# EAGLE board prism (EAGLE 6.5.0)
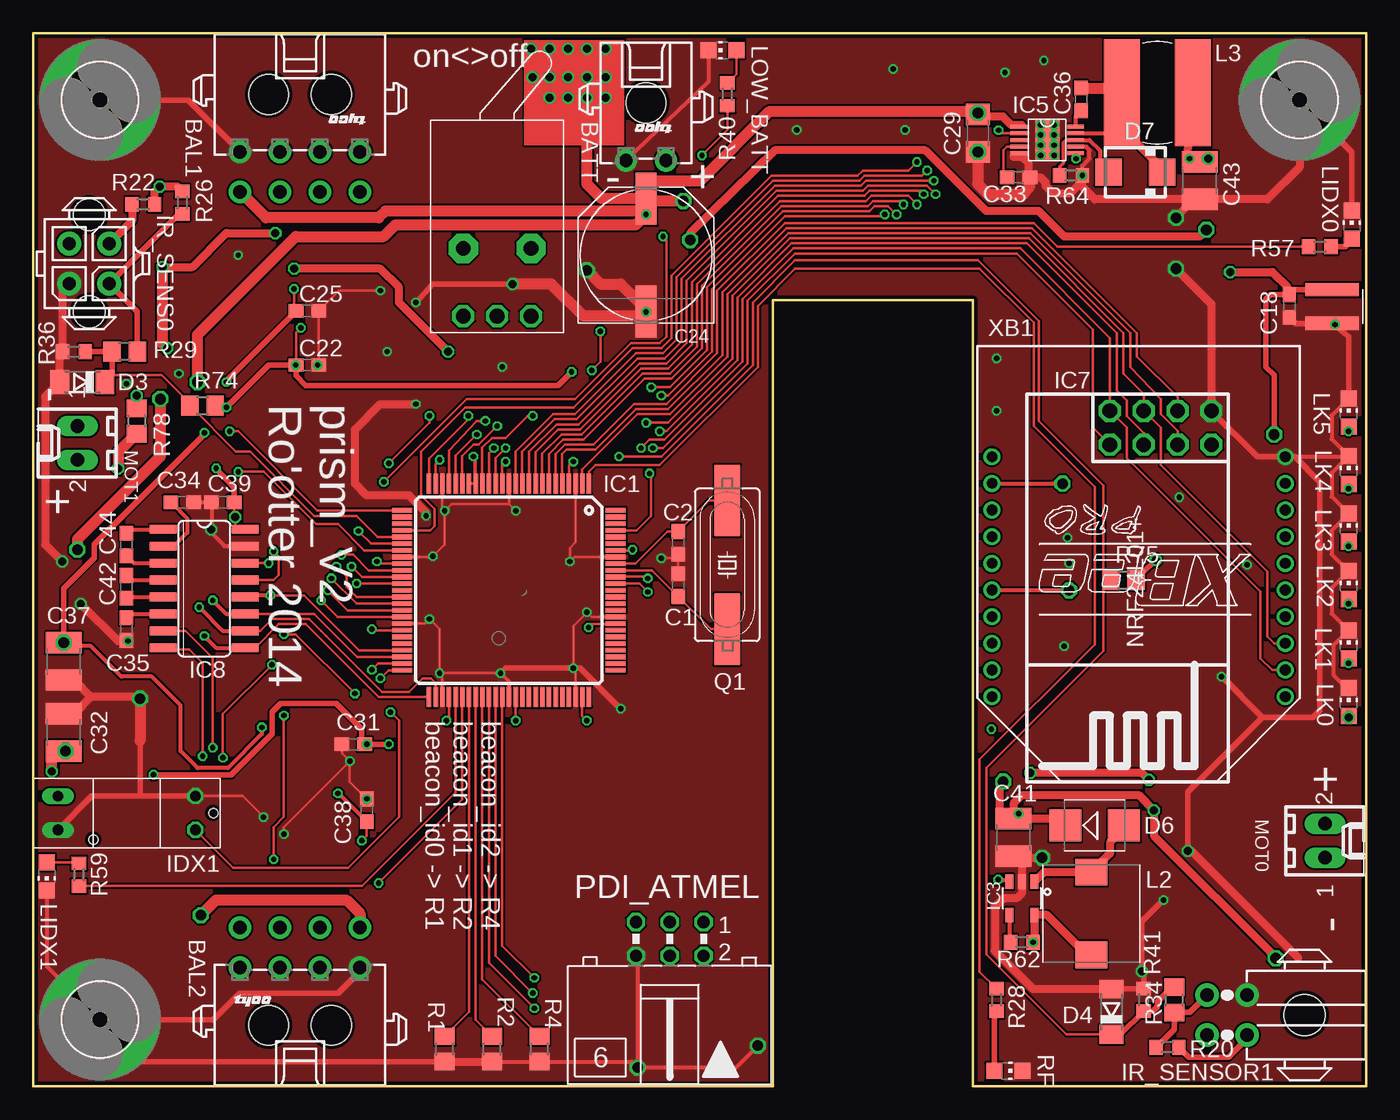
[diagram p2: board, top side]
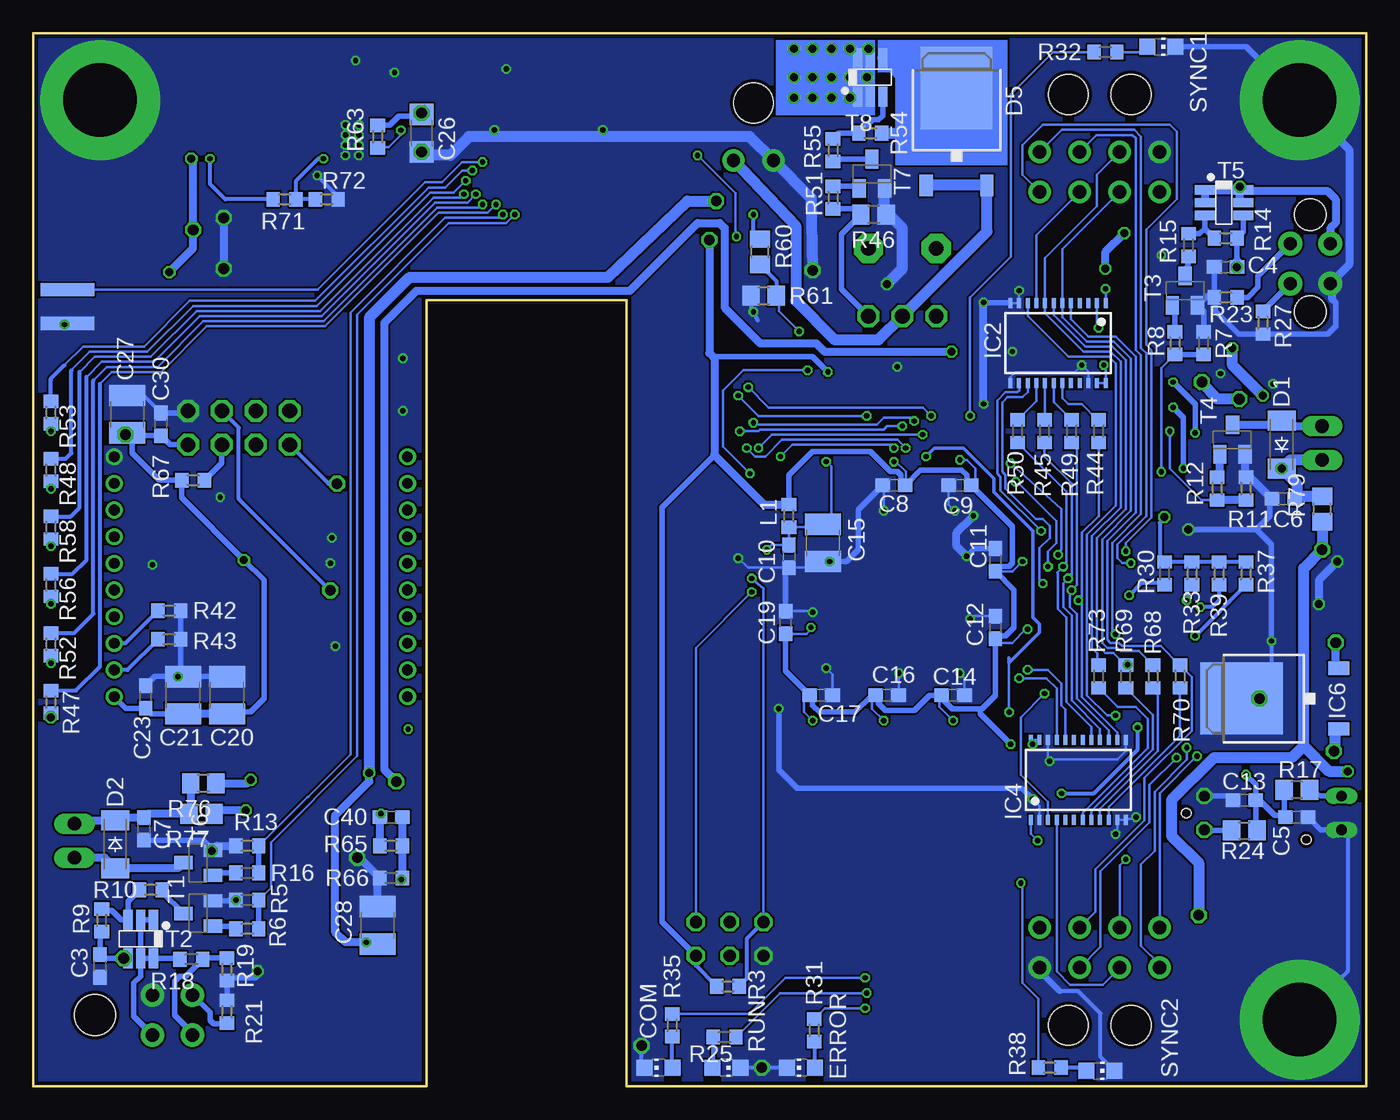
[diagram p3: board, bottom side, seen from below]

Size 100 x 79 mm. Coordinates in mm from the lower left corner, seen from the top.
Outline: 0,0 55.5,0 55.5,59 70.5,59 70.5,0 100,0 100,79 0,79 0,0
Copper layers (1*16): Top 0.035mm / dielectric 1.6mm / Bottom 0.035mm
Design rules "SeeedStudio_DRU_2layer": minimum track width 6mil, minimum drill 12mil, track to track 6mil, track to pad 6mil, pad to pad 6mil, via to via 6mil, smd to smd 0mil, copper to edge 10mil, drill to drill 10mil, minimum pad ring 6mil, minimum via ring 6mil, stop-mask expansion 2mil, vias tented up to drill 25mil, thermal gap 10mil

## Footprints (pad centres in the part's own frame; a part is rotated, then mirrored left to right if it is on the bottom)
794618-8 = drill 1 pad 1.676: 1 4.5,4.32; 2 1.5,4.32; 3 -1.5,4.32; 4 -4.5,4.32; 5 4.5,7.32; 6 1.5,7.32; 7 -1.5,7.32; 8 -4.5,7.32 | hole 3: -2.35,0; 2.35,0
1445055-2 = drill 1 pad 1.676: 1 1.5,4.32; 2 -1.5,4.32 | hole 3: 0,0
C0603 = smd 1.1 x 1: 1 -0.85,0; 2 0.85,0
C1210 = smd 1.6 x 2.7: 1 -1.4,0; 2 1.4,0
PANASONIC_G = smd 3.9 x 1.6: + 4.25,0; - -4.25,0
C1206 = smd 1.6 x 1.8: 1 -1.4,0; 2 1.4,0
CHIP-LED0805 = smd 1.2 x 1.2: A 0,-1.05; C 0,1.05
SOD-123_MINI-SMA = smd 1.5 x 2.1: A 1.8,0; C -1.8,0
SOD80C = smd 1.4 x 1.8: A 1.7,0; C -1.7,0
TO252 = smd 1 x 1.6: 1 -2.28,-4.8; 3 2.28,-4.8 | smd 5.4 x 6.2: 4 0,2.5
SMB = smd 2.4 x 2.4: A 2.2,0; C -2.2,0
SMA = smd 2 x 2: A 2,0; C -2,0
5,5-PAD = drill 5.5 pad 9: B5,5 0,0
TQFP100 = smd 1.5 x 0.347: 1 -8,6; 2 -8,5.5; 3 -8,5; 4 -8,4.5; 5 -8,4; 6 -8,3.5; 7 -8,3; 8 -8,2.5; 9 -8,2; 10 -8,1.5; 11 -8,1; 12 -8,0.5; 13 -8,0; 14 -8,-0.5; 15 -8,-1; 16 -8,-1.5; 17 -8,-2; 18 -8,-2.5; 19 -8,-3; 20 -8,-3.5; 21 -8,-4; 22 -8,-4.5; 23 -8,-5; 24 -8,-5.5; 25 -8,-6; 51 8,-6; 52 8,-5.5; 53 8,-5; 54 8,-4.5; 55 8,-4; 56 8,-3.5; 57 8,-3; 58 8,-2.5; 59 8,-2; 60 8,-1.5; 61 8,-1; 62 8,-0.5; 63 8,0; 64 8,0.5; 65 8,1; 66 8,1.5; 67 8,2; 68 8,2.5; 69 8,3; 70 8,3.5; 71 8,4; 72 8,4.5; 73 8,5; 74 8,5.5; 75 8,6 | smd 0.347 x 1.5: 26 -6,-8; 27 -5.5,-8; 28 -5,-8; 29 -4.5,-8; 30 -4,-8; 31 -3.5,-8; 32 -3,-8; 33 -2.5,-8; 34 -2,-8; 35 -1.5,-8; 36 -1,-8; 37 -0.5,-8; 38 0,-8; 39 0.5,-8; 40 1,-8; 41 1.5,-8; 42 2,-8; 43 2.5,-8; 44 3,-8; 45 3.5,-8; 46 4,-8; 47 4.5,-8; 48 5,-8; 49 5.5,-8; 50 6,-8; 76 6,8; 77 5.5,8; 78 5,8; 79 4.5,8; 80 4,8; 81 3.5,8; 82 3,8; 83 2.5,8; 84 2,8; 85 1.5,8; 86 1,8; 87 0.5,8; 88 0,8; 89 -0.5,8; 90 -1,8; 91 -1.5,8; 92 -2,8; 93 -2.5,8; 94 -3,8; 95 -3.5,8; 96 -4,8; 97 -4.5,8; 98 -5,8; 99 -5.5,8; 100 -6,8
TSSOP24 = smd 0.3 x 0.75: 1 -3.575,-3; 2 -2.925,-3; 3 -2.275,-3; 4 -1.625,-3; 5 -0.975,-3; 6 -0.325,-3; 7 0.325,-3; 8 0.975,-3; 9 1.625,-3; 10 2.275,-3; 11 2.925,-3; 12 3.575,-3; 13 3.575,3; 14 2.925,3; 15 2.275,3; 16 1.625,3; 17 0.975,3; 18 0.325,3; 19 -0.325,3; 20 -0.975,3; 21 -1.625,3; 22 -2.275,3; 23 -2.925,3; 24 -3.575,3
SOT23-5 = smd 0.6 x 1.1: 1 -0.95,-1.25; 2 0,-1.25; 3 0.95,-1.25; 4 0.95,1.25; 5 -0.95,1.25
MSOP10_THERMAL = smd 0.3 x 1.25: 1 -1,-2.127; 2 -0.5,-2.127; 3 0,-2.127; 4 0.5,-2.127; 5 1,-2.127; 6 1,2.127; 7 0.5,2.127; 8 0,2.127; 9 -0.5,2.127; 10 -1,2.127 | smd 3 x 1.8: THERMAL 0,0
DPACK_3 = smd 1 x 1.6: 1 -2.28,-4.8; 3 2.28,-4.8 | smd 5.4 x 6.2: 4 0,2.5
NRF24L01+ = drill 1.1 octagon: 1 1.27,-3.81; 2 -1.27,-3.81; 3 1.27,-1.27; 4 -1.27,-1.27; 5 1.27,1.27; 6 -1.27,1.27; 7 1.27,3.81; 8 -1.27,3.81
SO16 = smd 0.66 x 2.032: 1 -4.445,-3.073; 2 -3.175,-3.073; 3 -1.905,-3.073; 4 -0.635,-3.073; 5 0.635,-3.073; 6 1.905,-3.073; 7 3.175,-3.073; 8 4.445,-3.073; 9 4.445,3.073; 10 3.175,3.073; 11 1.905,3.073; 12 0.635,3.073; 13 -0.635,3.073; 14 -1.905,3.073; 15 -3.175,3.073; 16 -4.445,3.073
PRISM_INDEX_EXTENSION_MALE = smd 4 x 1: 1 0,-1.27; 2 0,1.27 | smd 4 x 1 bottom: 3 0,-1.27; 4 0,1.27
GP1S58VJ000F = drill 0.8 long: LED_A 5.15,-1.27; LED_C 5.15,1.27 | drill 0.8 octagon: TRANSISTOR_C -5.15,1.27; TRANSISTOR_E -5.15,-1.27 | hole 0.7: -6.5,0; 2.5,2
794681-4 = drill 1 pad 1.778: 1 1.5,-1.5; 2 1.5,1.5; 3 -1.5,-1.5; 4 -1.5,1.5 | hole 2.4: 3.63,0; -3.67,0
794618-4 = drill 1 pad 1.778: 1 1.5,4.32; 2 1.5,7.32; 3 -1.5,4.32; 4 -1.5,7.32 | hole 3.1: 0,0
R0603 = smd 1 x 1.1: 1 -0.85,0; 2 0.85,0
SRR7032 = smd 2 x 2.4: 1 -3.1,0; 2 3.1,0
SDR0805 = smd 8 x 2.7: 1 0,-2.65; 2 0,2.65
6410-02 = drill 1.016 long: 1 1.27,0; 2 -1.27,0
ML6L = drill 0.914 octagon: 1 -2.54,-1.27; 2 -2.54,1.27; 3 0,-1.27; 4 0,1.27; 5 2.54,-1.27; 6 2.54,1.27
HC49UP = smd 5.334 x 1.93: 1 -4.826,0; 2 4.826,0
R0805 = smd 1.3 x 1.5: 1 -0.95,0; 2 0.95,0
2MS1T2B4M6QNS = drill 1.1 octagon: 1 2.54,0; 2 0,0; 3 -2.54,0 | drill 1.1 pad 2.184 octagon: NC0 -2.54,-5.08; NC1 2.54,-5.08
SOT23-BEC = smd 1 x 1.4: B -0.95,-1.1; C 0,1.1; E 0.95,-1.1
TSOP-6 = smd 0.7 x 1.5: 1 -0.95,-1.45; 2 0,-1.45; 3 0.95,-1.45; 4 0.95,1.45; 5 0,1.45; 6 -0.95,1.45
XBEE-PRO = drill 0.8 pad 1.27: 1 -11,9; 2 -11,7; 3 -11,5; 4 -11,3; 5 -11,1; 6 -11,-1; 7 -11,-3; 8 -11,-5; 9 -11,-7; 10 -11,-9; 11 11,-9; 12 11,-7; 13 11,-5; 14 11,-3; 15 11,-1; 16 11,1; 17 11,3; 18 11,5; 19 11,7; 20 11,9

## Placement (x,y rotation side)
BAL1  794618-8  [794618-8]  20,74.42 180 top
BAL2  794618-8  [794618-8]  20,4.57 0 top
BATT  1445055-2  [1445055-2]  45.97,73.79 180 top
C1  15pF_0603_100V  [C0603]  48.39,37.59 90 top
C2  15pF_0603_100V  [C0603]  48.39,40.77 270 top
C3  100nF 50V  [C0603]  95,9.02 270 bottom
C4  100nF 50V  [C0603]  10.54,61.47 180 bottom
C5  100nF 50V  [C0603]  5.21,20.19 0 bottom
C6  100nF 50V  [C0603]  6.22,44.07 180 bottom
C7  100nF 50V  [C0603]  91.69,19.3 270 bottom
C8  100nF 50V  [C0603]  35.43,45.09 180 bottom
C9  100nF 50V  [C0603]  30.48,45.09 180 bottom
C10  100nF 50V  [C0603]  43.31,39.75 270 bottom
C11  100nF 50V  [C0603]  27.81,39.5 90 bottom
C12  100nF 50V  [C0603]  27.81,34.42 90 bottom
C13  100nF 50V  [C0603]  9.14,21.46 180 bottom
C14  100nF 50V  [C0603]  30.99,29.34 0 bottom
C15  10µF 25V  [C1210]  40.77,40.77 270 bottom
C16  100nF 50V  [C0603]  35.94,29.34 0 bottom
C17  100nF 50V  [C0603]  40.89,29.34 0 bottom
C18  100nF 50V  [C0603]  94.23,58.55 270 top
C19  100nF 50V  [C0603]  43.56,34.8 90 bottom
C20  10µF 25V  [C1210]  85.47,29.34 90 bottom
C21  10µF 25V  [C1210]  88.77,29.34 90 bottom
C22  100nF 50V  [C0603]  20.57,54.1 0 top
C23  100nF 50V  [C0603]  91.57,29.21 90 bottom
C24  330µF 35V  [PANASONIC_G]  45.97,62.36 90 top
C25  100nF 50V  [C0603]  20.57,58.17 0 top
C26  1µF 25V  [C1206]  70.87,71.5 270 bottom
C27  10µF 25V  [C1210]  92.96,50.42 90 bottom
C28  10µF 25V  [C1210]  74.17,12.06 90 bottom
C29  1µF 25V  [C1206]  70.87,71.5 270 top
C30  100nF 50V  [C0603]  90.42,49.66 90 bottom
C31  100nF 50V  [C0603]  24,25.65 180 top
C32  10µF 25V  [C1210]  2.29,26.54 90 top
C33  10nF 50V  [C0603]  73.91,68.2 0 top
C34  100nF 50V  [C0603]  11.18,43.81 0 top
C35  100nF 50V  [C0603]  6.99,34.29 270 top
C36  100nF 50V  [C0603]  78.61,74.04 90 top
C37  10µF 25V  [C1210]  2.29,31.88 270 top
C38  100nF 50V  [C0603]  25.02,20.7 90 top
C39  100nF 50V  [C0603]  14.22,43.81 180 top
C40  180pF 50V  [C0603]  73.15,20.19 0 bottom
C41  10µF 25V  [C1210]  73.53,18.67 270 top
C42  100nF 50V  [C0603]  6.99,37.47 270 top
C43  10µF 25V  [C1210]  87.5,67.94 270 top
C44  100nF 50V  [C0603]  6.99,40.64 270 top
COM  LED_G  [CHIP-LED0805]  53.09,1.4 90 bottom
D1  CGRM4004-G  [SOD-123_MINI-SMA]  6.35,48.13 90 bottom
D2  CGRM4004-G  [SOD-123_MINI-SMA]  93.85,18.16 270 bottom
D3  bzv55-c3v3  [SOD80C]  3.68,52.83 180 top
D4  bzv55-c3v3  [SOD80C]  80.9,5.59 90 top
D5  [TO252]  30.73,72.39 0 bottom
D6  B120-13-F  [SMB]  79.63,19.56 0 top
D7  B160-13F  [SMA]  82.68,68.58 180 top
ERROR  LED_G  [CHIP-LED0805]  42.42,1.4 90 bottom
H1  MOUNT-PAD-ROUND5.5  [5,5-PAD]  95,74 0 top
H2  MOUNT-PAD-ROUND5.5  [5,5-PAD]  5,5 0 top
H3  MOUNT-PAD-ROUND5.5  [5,5-PAD]  5,74 0 top
IC1  XMEGA128-A1  [TQFP100]  35.69,37.21 270 top
IC2  74LVC4245APW  [TSSOP24]  23.11,55.75 180 bottom
IC3  LM2731XMF  [SOT23-5]  74.17,14.1 180 top
IC4  74LVC4245APW  [TSSOP24]  21.59,22.99 0 bottom
IC5  LM25011MY  [MSOP10_THERMAL]  76.07,70.99 270 top
IC6  NCV78M05BDTRKG  [DPACK_3]  6.86,29.08 90 bottom
IC7  NRF24L01+  [NRF24L01+]  84.58,49.4 90 top
IC8  MAX3232CSE  [SO16]  12.83,37.34 270 top
IDX0  PRISM_INDEX_EXTENSION_MALE  [PRISM_INDEX_EXTENSION_MALE]  97.45,58.5 0 top
IDX1  GP1S58VJ000F  [GP1S58VJ000F]  7,20.5 180 top
IR_SENS0  794681-4  [794681-4]  4.19,61.72 270 top
IR_SENSOR1  794618-4  [794618-4]  95.38,5.33 90 top
L1  220 ohms  [R0603]  43.31,42.8 90 bottom
L2  SRR7032-100M  [SRR7032]  79.38,12.95 90 top
L3  SDR0805-270KL  [SDR0805]  84.33,74.55 270 top
LIDX0  LED_G  [CHIP-LED0805]  98.93,64.64 0 top
LIDX1  LED_G  [CHIP-LED0805]  1.02,15.75 180 top
LK0  LED_G  [CHIP-LED0805]  98.68,28.83 0 top
LK1  LED_G  [CHIP-LED0805]  98.68,33.15 0 top
LK2  LED_G  [CHIP-LED0805]  98.68,37.59 0 top
LK3  LED_G  [CHIP-LED0805]  98.68,41.91 0 top
LK4  LED_G  [CHIP-LED0805]  98.68,46.23 0 top
LK5  LED_G  [CHIP-LED0805]  98.68,50.55 0 top
LOW_BATT  LED_R  [CHIP-LED0805]  51.69,77.72 90 top
MOT0  22-27-2021-02  [6410-02]  96.9,18.41 270 top
MOT1  22-27-2021-02  [6410-02]  3.3,48.26 90 top
PDI_ATMEL  [ML6L]  47.75,11.05 180 top
Q1  [HC49UP]  52.07,39.12 90 top
R1  0-E  [R0805]  30.86,2.79 90 top
R2  0-E  [R0805]  34.42,2.79 90 top
R3  10K-F  [R0603]  47.88,7.49 0 bottom
R4  0-E  [R0805]  37.97,2.79 90 top
R5  10K-F  [R0603]  83.95,13.97 0 bottom
R6  1k  [R0603]  83.95,11.81 180 bottom
R7  10K-F  [R0603]  12.19,55.75 270 bottom
R8  1k  [R0603]  14.35,55.75 90 bottom
R9  10K-F  [R0603]  94.87,12.45 270 bottom
R10  10K-F  [R0603]  91.19,14.73 180 bottom
R11  10K-F  [R0603]  9.02,44.83 270 bottom
R12  1k  [R0603]  11.18,44.83 90 bottom
R13  10K-F  [R0603]  83.95,18.03 0 bottom
R14  10K-F  [R0603]  10.54,63.63 0 bottom
R15  10K-F  [R0603]  13.34,63.12 90 bottom
R16  1k  [R0603]  83.95,16 180 bottom
R17  100-E  [R0805]  5.21,22.23 180 bottom
R18  0  [R0603]  88.14,9.53 180 bottom
R19  nc  [R0603]  85.47,8.76 90 bottom
R20  10K-F  [R0603]  85.09,2.92 0 top
R21  nc  [R0603]  85.47,5.59 270 bottom
R22  0-F  [R0603]  8.26,66.17 0 top
R23  0-F  [R0603]  10.54,59.18 0 bottom
R24  270-E  [R0805]  9.14,19.18 0 bottom
R25  270-F  [R0603]  48.13,3.68 180 bottom
R26  10K-F  [R0603]  11.18,66.29 90 top
R27  nc  [R0603]  7.75,57.28 90 bottom
R28  270-F  [R0603]  72.26,6.48 270 top
R29  8K2-E  [R0805]  6.86,55.12 180 top
R30  10K-F  [R0603]  15.11,38.48 270 bottom
R31  270-F  [R0603]  41.4,4.19 270 bottom
R32  270-F  [R0603]  19.56,77.6 180 bottom
R33  10K-F  [R0603]  13.08,38.48 270 bottom
R34  8K2-E  [R0805]  85.6,6.48 90 top
R35  270-F  [R0603]  52.07,4.57 270 bottom
R36  3K09-F  [R0603]  3.05,55.12 0 top
R37  10K-F  [R0603]  9.02,38.48 90 bottom
R38  270-F  [R0603]  23.75,1.4 180 bottom
R39  10K-F  [R0603]  11.05,38.48 90 bottom
R40  270-F  [R0603]  52.07,74.42 90 top
R41  3K09-F  [R0603]  83.31,6.48 270 top
R42  10K-F  [R0603]  89.79,35.69 180 bottom
R43  10K-F  [R0603]  89.79,33.53 180 bottom
R44  0-F  [R0603]  20.07,49.15 90 bottom
R45  0-F  [R0603]  24.13,49.15 90 bottom
R46  10K-E  [R0805]  36.96,65.41 180 bottom
R47  270-F  [R0603]  98.68,28.83 270 bottom
R48  270-F  [R0603]  98.68,46.23 270 bottom
R49  0-F  [R0603]  22.1,49.15 90 bottom
R50  0-F  [R0603]  26.16,49.15 90 bottom
R51  1K-F  [R0603]  40.01,66.67 90 bottom
R52  270-F  [R0603]  98.68,33.15 270 bottom
R53  270-F  [R0603]  98.68,50.55 270 bottom
R54  10K-F  [R0603]  37.21,71.5 0 bottom
R55  10K-F  [R0603]  40.01,70.23 90 bottom
R56  270-F  [R0603]  98.68,37.59 270 bottom
R57  270-F  [R0603]  96.52,62.99 0 top
R58  270-F  [R0603]  98.68,41.91 270 bottom
R59  270-F  [R0603]  3.43,15.88 90 top
R60  15k 1%  [R0805]  45.47,62.61 90 bottom
R61  1k  [R0805]  45.21,59.31 0 bottom
R62  10K_1%-F  [R0603]  74.17,10.79 0 top
R63  75K-F  [R0603]  74.17,71.25 90 bottom
R64  0.27-F  [R0603]  77.85,68.33 180 top
R65  113K-F  [R0603]  73.15,18.03 0 bottom
R66  10K_1%-F  [R0603]  73.15,15.62 0 bottom
R67  10K-F  [R0603]  88.01,45.47 180 bottom
R68  0-F  [R0603]  16,30.73 90 bottom
R69  0-F  [R0603]  18.03,30.73 90 bottom
R70  0-F  [R0603]  13.97,30.73 90 bottom
R71  3K09-F  [R0603]  81.15,66.55 0 bottom
R72  10K-F  [R0603]  77.98,66.55 0 bottom
R73  0-F  [R0603]  20.07,30.73 90 bottom
R74  270-E  [R0805]  12.7,51.05 0 top
R75  270-E  [R0805]  81.79,37.97 0 top
R76  0-E  [R0805]  87.25,22.73 180 bottom
R77  0-E  [R0805]  87.38,20.45 180 bottom
R78  0-E  [R0805]  7.75,49.91 270 top
R79  0-E  [R0805]  3.3,43.31 90 bottom
RF  YELLOW  [CHIP-LED0805]  73.15,1.14 270 top
RUN  LED_G  [CHIP-LED0805]  48.01,1.4 270 bottom
SW_BATT  2MS1T2B4M6QNS  [2MS1T2B4M6QNS]  34.8,57.78 180 top
SYNC1  LED_B  [CHIP-LED0805]  15.37,77.98 270 bottom
SYNC2  LED_B  [CHIP-LED0805]  19.94,1.14 270 bottom
T1  MMBT2222LT1G  [SOT23-BEC]  87.63,12.95 90 bottom
T2  NTGS4111PT1G  [TSOP-6]  91.95,11.05 180 bottom
T3  MMBT2222LT1G  [SOT23-BEC]  13.59,59.69 0 bottom
T4  MMBT2222LT1G  [SOT23-BEC]  10.03,48.51 0 bottom
T5  NTGS4111PT1G  [TSOP-6]  10.67,66.29 270 bottom
T6  MMBT2222LT1G  [SOT23-BEC]  87.63,16.76 90 bottom
T7  MMBT2222LT1G  [SOT23-BEC]  37.08,68.45 0 bottom
T8  NTGS4111PT1G  [TSOP-6]  37.21,75.69 0 bottom
XB1  XBEE-PRO  [XBEE-PRO]  82.93,38.23 180 top

## Tracks (layer width: path | path; a pad name or v marks a point on that pad's centre or on a via)
+3V3  (via drill 0.4, 0.6, 0.8)
  Top 0.2: v19.68,54.1 19.68,54.06 C22.1 19.72,56.55 v20.07,56.9 | C31.1 v25.02,25.65 | C39.1 15.07,42.8 v15.16,42.72 15.16,41.99 15.37,41.78 IC8.16 | IC1.54 31.19,27.63 v30.99,27.43 | v36.2,27.43 IC1.64 | IC1.74 41.19,27.77 v41.53,27.43 | IC1.83 43.65,34.67 41.91,34.67 v41.66,34.42 | v35.43,46.86 35.19,46.6 IC1.14 | v25.78,39.37 26,39.21 IC1.34 | v25.4,34.29 25.48,34.21 IC1.44 | IC1.24 30.19,46.7 v30.48,46.99 | R74.2 13.78,50.93 v14.48,50.93
  Top 0.406: IDX0.2 94.61,59.77 C18.1 92.8,59.4 92.46,59.05 92.46,53.98 93.09,53.34 v93.09,48.9 | v9.02,23.37 14.86,23.37 17.91,26.42 17.91,28.07 18.54,28.7 22.73,28.7 24.64,26.8 24.64,25.87 C31.1 | v26.67,25.65 v25.02,25.65 | C39.1 15.07,44.87 v13.72,46.35 | v14.48,50.93 17.65,54.1 C22.1 19.72,53.3 20.45,52.58 39.37,52.58 v40.39,53.59 | R75.2 83.25,38.54 v84.2,39.5
  Top 0.61: L3.2 86.6,70.12 86.61,69.6 v86.74,69.6 87.12,69.6 | 87.12,69.6 C43.1 | 87.12,69.6 87.37,69.6 C43.1 | v89.79,61.09 92.96,61.09 94.11,59.94 94.11,59.52 C18.1 | v88.14,69.6 88.01,69.47 C43.1 | v88.01,64.26 87.5,63.75 77.34,63.75 75.44,65.66 71.5,65.66 66.93,70.23 55.63,70.23 49.28,64.01 v49.28,63.5
  Bottom 0.2: IC2.23 IC2.24 19.54,53.96 v19.68,54.1 | IC4.23 IC4.24 25.15,25.97 v25.02,25.65 | v30.99,27.43 32,28.45 32,29.17 C14.1 | C16.1 37.08,29.34 37.08,28.32 v36.2,27.43 | v41.53,27.43 42.16,28.07 42.16,29.34 C17.1 | v41.66,34.42 41.66,34.29 42,33.95 C19.1 | C8.1 34.54,45.12 34.54,46.1 35.31,46.86 v35.43,46.86 | C11.1 27.73,38.61 26.54,38.61 v25.78,39.37 | C12.1 27.73,33.66 27.73,33.31 27.69,33.27 26.54,33.27 25.53,34.29 v25.4,34.29 | IC2.2 20.19,57.02 v20.07,56.9 | v30.48,46.99 29.97,46.99 29.34,46.35 29.34,45.34 29.59,45.09 C9.1
  Bottom 0.305: R71.1 85.6,66.55 86.74,67.69 v86.74,69.6 | R3.1 50.29,9.06 PDI_ATMEL.2 | v15.16,42.72 15.49,42.29 15.49,39.71 R30.1 R33.1 R39.2 R37.2
  Bottom 0.406: 8.17,18.92 R24.2 8.29,19.28 C13.1 | C13.1 8,21.46 6.86,20.32 6.16,20.32 | IC7.2 89.75,48.13 C30.1 92.75,48.81 C27.1 | C21.1 91.14,27.94 C23.1 93.06,28.36 XB1.1 | C20.1 85.34,28.07 83.69,28.07 82.68,29.08 82.68,37.97 v84.2,39.5 88.86,44.16 R67.2 90.55,45.47 92.58,47.5 92.58,48.64 C27.1 | C27.1 v93.09,48.9 | 28.96,28.32 28.83,28.32 27.81,29.34 C12.1 27.81,33.78 27.05,33.78 26.42,34.42 26.42,37.25 C11.1 27.81,38.99 26.8,38.99 26.54,39.24 26.54,42 C9.1 29.97,45.09 29.97,45.85 30.35,46.23 33.44,46.23 C8.1 34.92,45.43 34.92,45.85 35.18,46.1 35.69,46.1 37.21,47.62 41.53,47.62 43.31,45.85 L1.2 | 28.96,28.32 31.06,28.32 31.84,29.1 C14.1 32.77,29.34 33.91,28.19 36.07,28.19 36.58,28.7 36.58,29.12 C16.1 | 37.08,29.34 38.35,28.07 41.02,28.07 41.53,28.57 41.53,29.12 C17.1 43.56,31.15 C19.1 | PDI_ATMEL.2 52.83,12.32 52.83,43.43 48.9,47.37 | C13.1 8.29,22.64 v9.02,23.37 | v26.67,25.65 28.96,27.94 28.96,28.32 | v13.72,46.35 13.72,50.16 v14.48,50.93 | v40.39,53.59 41.53,54.74 48.77,54.74 48.9,54.61 | C5.1 6.06,20.32 6.16,20.32 | 6.16,20.32 R17.2
  Bottom 0.61: v89.79,61.09 88.01,62.87 v88.01,64.26 88.01,69.47 v88.14,69.6 | L1.2 45.17,43.65 48.9,47.37 48.9,54.61 49.28,54.99 v49.28,63.5 | C20.1 C21.1
+5V  (via drill 0.4, 0.8)
  Top 0.2: C38.1 25.02,18.8 v24.64,18.41 | C25.1 19.56,58.33 v19.56,59.82
  Top 0.305: C38.1 22.9,21.97 v22.86,21.97 | v17.14,26.92 17.14,26.42 14.61,23.88 12.32,23.88 11.05,25.15 11.05,28.57 8.89,30.73 6.6,30.73 4.32,33.02 2.54,33.02 C37.1
  Top 0.406: C37.1 2.28,37.34 4.57,39.62 4.57,40.64 12.83,48.9 v12.83,49.02 | v14.48,52.83 14.48,52.92 C25.1
  Top 0.61: C37.1 1.78,33.27 1.78,33.28 C37.1
  Bottom 0.2: v24.64,18.41 25.16,18.94 IC4.1 | v19.56,59.82 19.54,59.67 IC2.1
  Bottom 0.305: v22.86,21.97 20.45,21.97 17.14,25.27 v17.14,26.92
  Bottom 0.406: v12.83,49.02 12.83,51.18 v14.48,52.83
  Bottom 0.61: IC6.3 2.29,31.39 C37.1
  other vias: 2.29,33.28
+15V  (via drill 0.4, 0.6, 0.8)
  Top 0.61: v73.91,20.45 C41.1 | D6.C 76.92,20.07 74.55,20.07 C41.1 | C41.1 | v93.22,9.6 93.22,9.65 84.07,18.8 v84.07,20.7 82.93,21.84 74.17,21.84 73.53,21.21 C41.1 | C41.1 72.89,20.07 72.52,20.45 72.52,22.61 v72.77,22.86 | v31.11,55.12 27.43,58.8 27.43,59.94 26.04,61.34 v19.56,61.34 | C4.1 11.94,61.47 14.48,64.01 v18.16,64.01
  Top 0.813: R78.1 v7.75,51.82 | v10.03,55.37 9.69,55.71 C4.1
  Bottom 0.406: 9.69,61.98 R14.2 9.22,64.1 T5.4 | R9.2 95,11.47 C3.1 94.73,9.6 v93.22,9.6
  Bottom 0.61: R65.1 C40.1 73.91,20.28 v73.91,20.45 | v93.22,9.6 T2.4 | v72.77,22.86 73.66,23.75 73.66,57.28 71.25,59.69 55.24,59.69 50.16,64.77 48.51,64.77 48.13,64.39 48.13,58.42 45.47,55.75 41.27,55.75 40.64,55.12 v31.11,55.12 | v19.56,61.34 19.56,62.61 v18.16,64.01 | C4.1 9.69,61.98 | v84.07,20.7 86.43,20.7 R77.1
  Bottom 0.813: v7.75,51.82 10.03,54.1 v10.03,55.37
  other vias: 9.69,61.47
/RESET_3V3  (via drill 0.4)
  Top 0.2: v46.1,38.1 45.97,38.23 43.7,38.23 IC1.90
  Bottom 0.2: PDI_ATMEL.5 45.21,37.34 v46.1,38.1
  Bottom 0.305: PDI_ATMEL.5 46.48,11.05 46.48,8.04 R3.2
BATTERY_MONITOR_0-1V  (via drill 0.4)
  Top 0.2: IC1.97 45.27,41.71 46.35,42.8 46.35,45.85 v46.23,45.97 | v42.55,56.64 42.55,55.24 42.55,54.36 42.04,53.85 v41.91,53.72
  Bottom 0.2: v46.23,45.97 48.26,48.01 48.26,52.2 46.74,53.72 v41.91,53.72 | 44.07,59.12 44.07,58.17 v42.55,56.64
  Bottom 0.305: R60.1 45.53,61.59 45.47,61.59 44.26,60.39 R61.2 44.07,59.12
BEACON_ID_0_3V3
  Top 0.2: R1.2 32.69,5.57 IC1.57
BEACON_ID_1_3V3
  Top 0.2: R2.2 33.19,4.97 IC1.58
BEACON_ID_2_3V3
  Top 0.2: R4.2 33.69,8.03 IC1.59
GND  (via drill 0.4, 0.6, 0.8)
  Top 0.2: IC5.5 73.53,69.72 | v21.34,54.1 C22.2 C25.2 22.95,59.69 v26.04,59.69 | C31.2 23.15,24.98 v23.75,24.38 | IC1.53 30.69,30.78 v30.48,30.99 | IC1.73 40.69,31.2 v40.51,31.37 40.51,34.54 v41.53,35.56 41.88,35.21 IC1.84 | IC1.93 40.6,39.71 v40.26,39.37 40.26,40.39 40.69,40.81 IC1.3 | v47.12,39.62 48.09,39.62 C2.2 C1.2 | v30.48,30.99 v35.05,30.99 | IC1.43 29.38,34.71 v29.72,35.05 30.48,34.29 v30.48,30.99 | v29.97,39.75 29.84,39.75 | IC1.33 29.93,39.71 v29.97,39.75 | v30.86,43.18 30.69,43.35 IC1.23 | v36.2,43.18 35.69,43.69 | 35.69,43.69 IC1.13 | 35.69,43.69 31.37,43.69 v30.86,43.18 | v30.86,43.18 30.86,40.64 v29.97,39.75 | v23.75,24.38 23.75,22.82 C38.2 | v18.8,18.92 18.8,19.43 v23.75,24.38 | v17.27,20.19 15.7,21.77 IDX1.TRANSISTOR_E
  Top 0.254: IC1.63 35.69,30.35 v35.05,30.99 35.43,31.37
  Top 0.305: IC5.7 78.99,70.48 79.25,70.23 79.25,69.6 78.7,69.05 R64.1 78.7,68.03 78.49,67.82 78.49,67.69 | LOW_BATT.C 50.64,75.38 BATT.1 | LK0.C 98.52,29.88 97.54,30.86 97.54,33.05 LK1.C 97.41,35.47 97.41,37.37 LK2.C 97.41,39.91 97.41,41.69 LK3.C 97.41,44.23 97.41,46.01 LK4.C | LK5.C 97.41,50.33 97.41,48.55 LK4.C | XB1.10 98.63,47.23 LK4.C | R2.1 R4.1 44.89,1.84 v45.34,1.4 | v54.36,3.05 52.7,1.4 v45.34,1.4 | PDI_ATMEL.6 45.34,9.65 v45.34,1.4 | LIDX1.C 1.02,8.98 H2.B5,5 | C34.2 C39.2 13.37,41.49 14.35,40.51 IC8.15 | C35.2 7.07,33.44 v7.11,33.4
  Top 0.406: 1.98,54.9 R36.1 | D4.A 83.27,7.29 R41.1 83.31,8.51 v83.19,8.64 83.19,12.36 R5.1 | LK5.C 98.68,56.25 IDX0.1 | IDX0.1 94.7,57.23 C18.2 | IDX0.1 97.28,57.19 v97.66,57.15 | LIDX0.C 98.93,70.07 H1.B5,5 | v89.15,30.73 92.2,27.69 | 92.2,27.69 96.01,27.69 96.52,28.19 96.52,45.34 94.63,47.23 XB1.10 91.84,47.23 IC7.1 | 92.2,27.69 86.61,22.1 v86.61,17.65 | BAL1.1 11.6,74 H3.B5,5 | R1.1 8.16,1.84 H2.B5,5 13.51,5 15.49,6.99 22.86,6.99 24.5,8.62 BAL2.1 | IDX1.LED_C 4.39,21.77 8,21.77 | 8,21.77 IDX1.TRANSISTOR_E | 8,25.92 8,21.77 | v44.07,28.32 41.02,31.37 v40.51,31.37 35.43,31.37 | 13.37,41.49 13.37,41.74 v13.34,41.78 | v28.7,58.8 29.97,60.2 v35.94,60.2
  Top 0.61: R36.1 2.2,59.73 IR_SENS0.1 | 1.98,54.9 D3.A 0.89,51.74 0.89,40.64 v2.16,39.37 | C43.2 87.12,66.55 87,66.55 | 87,66.55 79.63,66.55 78.7,67.48 R64.1 | v86.61,17.65 86.87,17.65 94.87,9.65 | D4.A 75.01,7.29 72.14,10.16 72.14,13.46 72.77,14.1 73.79,14.1 74.17,14.48 IC3.2 74.17,16.63 73.91,16.89 | C43.2 87,66.55 | 87,66.55 v85.72,65.15 | v85.72,61.34 88.39,58.67 IC7.1 | H1.B5,5 95,68.97 92.58,66.55 C43.2 | R1.1 R2.1 | C37.2 3.05,30.48 4.32,29.21 | 4.32,29.21 3.05,27.94 C32.2 | v8,29.08 7.87,29.21 4.32,29.21 | 74.17,69.72 73.53,69.72 | 74.17,69.72 74.68,69.22 74.68,68.29 C33.2 75.56,68.2 75.95,67.82 75.95,67.56 76.5,67.01 77.81,67.01 78.49,67.69 | 74.17,69.72 74.3,69.72 | v3.56,36.2 6.35,33.4 v7.11,33.4 | v75.69,17.14 74.17,17.14 73.91,16.89 | 73.91,16.89 C41.2 | v29.46,42.8 29.46,43.05 28.19,44.32 25.02,44.32 24.13,45.21 24.13,49.28 26.04,51.18 v28.7,51.18
  Top 0.813: v35.94,60.2 38.86,60.2 41.27,57.78 45.03,57.78 C24.- 45.34,58.93 44.07,60.2 42.55,60.2 v41.53,61.21 | C29.2 70.87,67.69 71.63,66.93 74.3,66.93 74.76,67.53 C33.2 | v8,29.08 8,25.92
  Bottom 0.2: IC2.22 20.84,53.6 v21.34,54.1 21.84,53.59 26.29,53.59 26.69,53.19 IC2.13 | IC4.22 23.86,24.5 v23.75,24.38 23.62,24.51 18.67,24.51 18.02,25.16 IC4.13 | v30.48,30.99 30.14,30.65 C14.2 | C16.2 35.05,29.38 v35.05,30.99 | C17.2 40.04,30.9 v40.51,31.37 | v40.26,39.37 C15.2 41.23,38.9 C10.2 46.39,38.9 v47.12,39.62 | C19.2 41.62,35.65 v41.53,35.56 | C12.2 29.5,35.27 v29.72,35.05 | C9.2 31.33,43.65 v30.86,43.18 | C8.2 36.2,45 v36.2,43.18 | IC4.2 24.52,21.05 C38.2 | v18.8,18.92 18.66,19.05 IC4.11 IC4.12 17.94,20.07 17.4,20.07 v17.27,20.19 | IC2.12 IC2.11 v26.04,59.69
  Bottom 0.305: 78.49,68.33 R64.1 77.13,66.75 R72.2 | 45.66,57.47 C24.- 46.16,58.3 R61.1 | C27.2 91.74,51.82 C30.2 | C21.2 v89.15,30.73 | v45.34,1.4 RUN.C | ERROR.C v45.34,1.4 | 45.21,1.52 v45.34,1.4 | COM.C 54.36,1.62 v54.36,3.05 | SYNC2.C 19.94,2.19 19.94,5.46 21.59,7.11 22.99,7.11 | IDX1.LED_C 1.7,19.23 1.4,18.92 1.4,8.6 H2.B5,5 | v7.11,33.4 7.11,29.97 v8,29.08
  Bottom 0.406: R23.1 C4.2 | R23.1 11.52,59.31 11.92,59.31 T3.E 12.19,58.14 R7.1 | R23.1 11.3,59.09 11.3,58.17 9.56,56.43 R27.1 2.88,56.43 2.29,57.02 2.29,58.8 2.54,59.05 | 2.54,60.07 IR_SENS0.1 | 9.93,21.27 C13.2 10.3,21.77 IDX1.TRANSISTOR_E | 85.34,13.9 84.86,13.9 R5.1 85.28,13.97 85.34,13.9 | 85.34,13.9 T1.E | v83.19,8.64 83.19,8.26 83.31,8.13 85.26,8.13 R19.1 R21.1 85.47,7.75 | T6.E 87.27,18.45 C7.2 | C30.2 88.56,50.51 IC7.1 | v97.66,57.15 97.7,57.19 IDX0.1 | C23.2 90.89,30.74 90.89,30.73 v89.15,30.73 | C20.2 C21.2 88.94,30.9 R43.1 R42.1 | SYNC1.C 8.98,77.98 H3.B5,5 | 22.99,7.11 24.5,8.62 BAL2.1 | C19.2 43.56,38.65 C10.2 | C8.2 38.1,43.27 38.1,40.26 38.99,39.37 v40.26,39.37 | C38.2 25.82,22.35 42.67,22.35 44.07,23.75 v44.07,28.32 | v13.34,41.78 8.26,41.78 | 8.26,41.78 7.24,42.8 7.24,43.9 C6.2 | 8.26,41.78 7.11,40.64 v7.11,33.4 | IC2.12 26.74,58.8 v28.7,58.8 | 73.79,13.72 74.17,13.34 | C11.2 29.38,40.35 v29.97,39.75 | C5.2 3.39,19.23 IDX1.LED_C
  Bottom 0.61: 2.54,59.05 2.54,60.07 | C6.2 8.69,45.68 R11.1 9.08,45.75 T4.E | R13.1 86.21,18.03 T6.E 86.55,17.71 v86.61,17.65 | v85.72,65.15 v85.72,61.34 | 7.62,29.08 v8,29.08 IC6.4 | IR_SENS0.1 1.27,61.64 1.27,70.27 H3.B5,5 | v2.16,39.37 3.56,37.97 v3.56,36.2 | v75.69,17.14 75.53,17.14 R66.1 74.17,15.46 C28.2 74.17,13.34 | v29.97,39.75 30.73,40.51 30.73,41.53 v29.46,42.8 | v28.7,51.18 v28.7,58.8
  Bottom 0.813: v35.94,60.2 34.8,61.34 34.8,64.39 35.81,65.41 R46.1 36.01,65.6 36.13,65.72 T7.E | v41.53,61.21 41.66,66.65 BATT.1 46.25,71.25 67.31,71.25 68.71,69.85 70.61,69.85 C29.2 | C29.2 | 70.87,69.97 C29.2
  other vias: 70.87,70.1 78.7,68.33 45.97,58.11 84.8,13.97 25.02,21.55 26.54,55.12 35.18,53.98 64.52,76.33 72.9,76.07 75.82,76.96 6.99,52.7 77.6,41.15 77.72,39.24 77.34,33.02 72.26,54.61 72.26,50.67 85.98,44.2 91.06,39.12 57.28,71.75 65.41,71.75 10.92,53.47 15.37,62.36 75.56,72.14 76.58,72.14 75.56,71.37 76.58,71.37 76.58,70.61 76.58,69.85 75.56,69.85 75.56,70.61
  pour Bottom (no thermals): -1.14,-1.27 -1.14,80.64 101.73,80.64 101.73,-1.27
  pour Top (no thermals): -3.94,-3.68 -3.94,82.42 101.98,82.42 101.98,-3.68
INT0_0_3V3  (via drill 0.4)
  Top 0.2: v22.73,38.99 23.5,38.23 23.5,37.47 24.25,36.71 IC1.39
  Bottom 0.2: IC4.17 20.61,26.96 22.48,28.83 22.48,35.18 23.11,35.81 23.11,38.48 23.18,38.54 v22.73,38.99 22.48,39.24 22.48,44.62 R50.1
INT0_0_5V
  Bottom 0.2: BAL1.2 20.19,68.41 20.19,66.04 24.09,62.14 IC2.8 24.09,58 21.21,55.12 19.18,55.12 18.41,54.36 18.41,43.43 20.57,41.27 20.57,32.89 20.15,32.47 20.15,31.2 R73.2
INT0_1_3V3  (via drill 0.4)
  Top 0.2: v22.35,38.1 24.24,36.21 IC1.40
  Bottom 0.2: R45.1 24.13,47.24 22.1,45.21 22.1,38.35 v22.35,38.1 22.73,37.72 22.73,35.94 22.1,35.31 22.1,28.96 19.96,26.82 IC4.16
INT0_1_5V  (via drill 0.4)
  Top 0.2: v17.91,31.62 14.22,27.94 v14.22,24.64
  Bottom 0.2: IC2.7 23.44,57.86 21.08,55.5 19.05,55.5 18.03,54.48 18.03,43.31 20.19,41.15 20.19,33.15 19.56,32.51 18.96,32.51 R69.2 18,31.62 v17.91,31.62 | BAL2.2 19.94,10.45 19.94,16.13 16.26,19.81 16.26,22.61 v14.22,24.64
INT1_0_3V3  (via drill 0.4)
  Top 0.2: v22.1,37.21 23.6,35.71 IC1.41
  Bottom 0.2: R49.1 22.1,48.26 21.72,47.88 21.72,37.59 v22.1,37.21 22.23,37.21 22.23,35.94 21.72,35.43 21.72,29.08 19.32,26.68 IC4.15
INT1_0_5V
  Bottom 0.2: BAL1.6 22.79,62.81 IC2.6 22.79,57.71 20.95,55.88 18.92,55.88 17.65,54.61 17.65,43.18 19.81,41.02 19.81,33.27 19.43,32.89 18.67,32.89 18.41,32.64 17.06,32.64 R68.2
INT1_1_3V3  (via drill 0.4)
  Top 0.2: v21.59,36.45 22.83,35.21 IC1.42
  Bottom 0.2: R44.1 20.07,42.8 21.34,41.53 21.34,36.7 v21.59,36.45 21.34,36.2 21.34,29.21 18.66,26.54 IC4.14
INT1_1_5V
  Bottom 0.2: IC2.5 22.14,57.57 20.83,56.26 18.8,56.26 17.27,54.74 17.27,43.05 19.43,40.89 19.43,33.53 19.18,33.27 18.54,33.27 18.29,33.02 15.41,33.02 R70.2 13.08,30.7 13.08,26.67 16.64,23.11 16.64,19.94 20.32,16.26 20.32,13.07 BAL2.6
IR_SENSOR_0_OUTPUT_3V3
  Top 0.2: IC1.30 25.84,41.21 24.26,42.8 21.08,42.8 16.26,47.62 15.75,47.62 15.24,47.62 15.18,47.62 R74.1 11.62,51.37 9.63,53.36 5.91,53.36
  Top 0.406: R36.2 R29.2 5.91,53.36 D3.C
IR_SENSOR_0_OUTPUT_24V
  Top 0.406: R20.1 85.6,4.28 R34.1 86.75,5.53 IR_SENSOR1.2
  Bottom 0.406: R21.2 85.51,4.7 86.49,4.7 86.75,4.96 86.75,5.53 IR_SENSOR1.2
IR_SENSOR_1_OUTPUT_3V3  (via drill 0.4)
  Top 0.2: D4.C 77.52,3.89 71.5,9.91 71.5,23.88 80.26,32.64 80.26,37.85 | 80.26,37.85 80.26,45.09 75.44,49.91 75.44,57.4 70.87,61.98 57.15,61.98 53.98,58.8 53.98,54.1 47.12,47.24 v43.94,47.24 | IC1.15 34.69,47.13 v35.43,47.88 | R75.1 80.39,37.97 80.26,37.85
  Top 0.406: D4.C 81.57,3.89 R41.2 83.99,5.63 84.33,5.97 84.33,6.35 84.96,6.99 85.16,6.99 R34.2
  Bottom 0.2: v35.43,47.88 35.69,48.13 43.05,48.13 v43.94,47.24
IR_SENSOR_1_OUTPUT_24V
  Top 0.406: R29.1 7.81,58.1 IR_SENS0.2 10.91,65.44 R26.1
  Bottom 0.406: R27.2 7.58,58.13 7.49,58.04 7.49,58.42 IR_SENS0.2
LED_INDEX_0_3V3
  Top 0.2: R57.1 76.83,62.99 75.06,64.77 56.39,64.77 51.31,59.69 51.31,54.99 47.5,51.18 45.09,51.18 42.04,48.13 39.88,48.13 39.19,47.44 IC1.6
LED_INDEX_1_3V3
  Top 0.2: R59.1 24.68,15.03 31.69,22.04 IC1.55
LK0_3V3  (via drill 0.4)
  Top 0.2: v65.28,66.17 65.02,66.42 62.99,66.42 62.61,66.04 56.13,66.04 50.16,60.07 50.16,55.37 47.88,53.09 45.85,53.09 41.27,48.51 39.75,48.51 38.69,47.45 IC1.7
  Bottom 0.2: 95,52.7 94.11,53.59 90.42,53.59 87,57.02 78.11,57.02 69.6,65.53 65.91,65.53 v65.28,66.17
  Bottom 0.305: R47.1 96.81,29.68 95,31.5 95,52.7
LK1  (via drill 0.4)
  Top 0.305: LK2.A v98.68,36.2
  Bottom 0.305: v98.68,36.2 R56.2
LK1_3V3  (via drill 0.4)
  Top 0.2: v66.29,66.17 65.66,66.8 62.87,66.8 62.48,66.42 56.01,66.42 49.78,60.2 49.78,55.5 47.75,53.47 45.72,53.47 41.15,48.9 39.62,48.9 38.19,47.46 IC1.8
  Bottom 0.2: 95.5,52.96 94.49,53.98 90.68,53.98 87.25,57.4 78.23,57.4 69.72,65.91 66.55,65.91 v66.29,66.17
  Bottom 0.305: R52.1 96.94,34 95.5,35.43 95.5,52.96
LK2_3V3  (via drill 0.4)
  Top 0.2: v66.8,66.93 66.55,67.18 62.74,67.18 62.36,66.8 55.88,66.8 49.4,60.33 49.4,55.63 47.62,53.85 45.59,53.85 41.02,49.28 39.37,49.28 37.69,47.59 IC1.9
  Bottom 0.2: 96.01,53.21 94.87,54.36 90.93,54.36 87.5,57.78 78.36,57.78 69.85,66.29 67.44,66.29 v66.8,66.93
  Bottom 0.305: R56.1 97.07,38.44 96.01,39.5 96.01,53.21
LK3_3V3  (via drill 0.4)
  Top 0.2: v67.69,66.93 67.06,67.56 62.61,67.56 62.23,67.18 55.75,67.18 49.02,60.45 49.02,55.75 47.5,54.23 45.47,54.23 40.89,49.66 39.24,49.66 37.19,47.6 IC1.10
  Bottom 0.2: 96.52,53.59 95.38,54.74 91.19,54.74 87.76,58.17 78.49,58.17 69.98,66.67 67.94,66.67 v67.69,66.93
  Bottom 0.305: R58.1 97.19,42.76 96.52,43.43 96.52,53.59
LK4_3V3  (via drill 0.4)
  Top 0.2: v67.56,67.94 62.48,67.94 62.1,67.56 55.63,67.56 48.64,60.58 48.64,55.88 47.37,54.61 45.34,54.61 40.77,50.04 39.12,50.04 36.69,47.61 IC1.11
  Bottom 0.2: 97.16,53.72 95.76,55.12 91.44,55.12 88.01,58.55 78.74,58.55 70.23,67.06 68.45,67.06 v67.56,67.94
  Bottom 0.305: R48.1 97.58,47.08 97.16,47.5 97.16,53.72
LK5
  Top 0.406: LIDX0.A 98.46,62.99 R57.2
LK5_3V3  (via drill 0.4)
  Top 0.2: v67.06,68.71 66.67,68.33 62.36,68.33 61.98,67.94 55.5,67.94 48.26,60.71 48.26,56.01 47.24,54.99 45.21,54.99 40.64,50.42 38.99,50.42 36.19,47.62 IC1.12
  Bottom 0.2: 97.66,54.1 96.27,55.5 91.69,55.5 88.27,58.93 78.87,58.93 70.36,67.44 69.09,67.44 67.82,68.71 v67.06,68.71
  Bottom 0.305: 98.68,52.96 R53.1 98.68,53.09 97.66,54.1
LOW_BAT_LED_3V3  (via drill 0.4)
  Top 0.2: v50.16,69.85 52.07,71.75 R40.1 | v47.24,63.75 47.5,63.5 47.5,56.26 46.99,55.75 44.83,55.75 40.64,51.56 32.51,51.56 v26.29,45.34 | v23.88,38.99 24.65,38.21 IC1.36
  Bottom 0.2: v50.16,69.85 47.31,66.99 47.31,63.82 v47.24,63.75 | v26.29,45.34 26.16,45.34 23.24,42.42 23.24,40.77 23.88,40.13 v23.88,38.99
MIRROR_INDEX_0_3V3  (via drill 0.4)
  Top 0.2: v66.29,69.34 65.66,68.71 62.23,68.71 61.85,68.33 55.37,68.33 47.88,60.83 47.88,56.13 47.12,55.37 44.96,55.37 40.51,50.93 32.38,50.93 29.08,47.62 29.08,44.32 30.1,43.31 30.1,42.04 29.77,41.71 IC1.29
  Bottom 0.2: IDX0.4 78.66,59.77 70.61,67.82 69.34,67.82 67.82,69.34 v66.29,69.34
MIRROR_INDEX_1_3V3  (via drill 0.4)
  Top 0.2: IDX1.TRANSISTOR_C 15,16.38 23.62,16.38 27.43,20.19 27.43,27.43 v26.8,28.07 | IC1.19 IC1.18
  Top 0.254: v33.02,47.24 33.15,47.12 33.15,45.25 IC1.18
  Bottom 0.2: v26.8,28.07 26.8,31.75
  Bottom 0.254: 26.8,32.13 26.8,31.75 24.51,34.04 24.51,34.67 25.02,35.18 25.02,41.66 27.94,44.58 27.94,45.59 30.23,47.88 32.38,47.88 v33.02,47.24
  Bottom 0.406: R24.1 12.1,19.18 IDX1.TRANSISTOR_C
MOTOR_M_0
  Bottom 0.61: MOT0.1 94.64,17.14 D2.A 89.13,16.36 T6.C
MOTOR_M_1
  Bottom 0.61: MOT1.1 5.95,49.53 D1.A 6.67,49.61 T4.C
MOTOR_PWM_0_3V3  (via drill 0.4)
  Top 0.2: v64.77,65.41 64.14,66.04 63.12,66.04 62.74,65.66 56.26,65.66 50.55,59.94 50.55,55.24 47.75,52.45 v46.35,52.45 | IC1.25 29.69,47.09 32.64,50.04 v32.64,50.29
  Bottom 0.2: R13.2 79.41,21.72 79.38,21.72 76.2,24.89 76.2,58.04 69.09,65.15 65.02,65.15 v64.77,65.41 | v46.35,52.45 44.83,50.93 33.27,50.93 v32.64,50.29
  Bottom 0.406: R13.2 R16.1
MOTOR_PWM_1_3V3  (via drill 0.4)
  Top 0.2: v14.73,49.15 15.37,49.15 21.3,43.21 IC1.26
  Bottom 0.2: R12.1 12.36,43.98 14.73,46.35 v14.73,49.15
  Bottom 0.61: R11.2 R12.1
N$1
  Top 0.305: C44.1 7.28,41.78 IC8.1
N$2
  Bottom 0.305: RUN.A 48.98,1.47 R25.2
N$3
  Bottom 0.61: R12.2 10.98,45.87 T4.B
N$4
  Bottom 0.305: ERROR.A 41.37,3.31 R31.2
N$5
  Top 0.305: C44.2 7.53,39.24 IC8.3
N$6
  Top 0.305: C42.1 7.33,37.97 IC8.4
N$7
  Bottom 0.305: COM.A 52.07,1.43 R35.2
N$8  (via drill 0.4)
  Top 0.2: v44.96,40.26 44.91,40.21 IC1.94 | v40.51,46.86 40.2,46.55 IC1.4
  Bottom 0.2: v44.96,40.26 44.62,40.6 C10.1 L1.1 40.98,41.95 C15.1 40.13,42.8 40.13,46.48 v40.51,46.86
N$9  (via drill 0.4)
  Top 0.2: IC1.61 34.69,9.76 v37.47,6.99
  Bottom 0.2: v37.47,6.99 43.98,6.99 R25.1
N$10  (via drill 0.4)
  Top 0.2: IC1.60 34.19,9.25 v37.59,5.84
  Bottom 0.2: v37.59,5.84 40.6,5.84 R31.1
  Bottom 0.305: R31.1 41.27,5.17
N$11
  Top 0.305: C34.1 11.56,42.58 11.56,41.53 10.54,40.51 IC8.2
N$12  (via drill 0.4)
  Top 0.2: IC1.62 35.19,10.53 v37.59,8.13
  Bottom 0.2: v37.59,8.13 43.56,8.13 46.27,5.42 R35.1
N$13
  Top 0.305: C35.1 7.28,35.43 IC8.6
N$14
  Bottom 0.406: R14.1 12.12,64.35 | 12.12,64.35 T5.3 | R15.2 12.5,63.97 12.12,64.35
N$16
  Bottom 0.406: R8.2 14.35,58.4 T3.B
N$17
  Bottom 0.406: R15.1 13.34,61.77 T3.C
N$18
  Bottom 0.406: R16.2 86.34,16 T6.B
N$19  (via drill 0.6)
  Top 0.2: LK0.A v98.68,27.69
  Bottom 0.2: v98.68,27.69 R47.2
N$20  (via drill 0.4)
  Top 0.305: LK1.A v98.68,31.75
  Bottom 0.305: v98.68,31.75 R52.2
N$22  (via drill 0.4)
  Top 0.305: LK3.A v98.68,40.51
  Bottom 0.305: v98.68,40.51 R58.2
N$23
  Bottom 0.813: 33.02,67.56 D5.1 D5.3 28.45,64.13 SW_BATT.2 36.58,56.01 39.88,56.01 42.8,58.93 42.8,64.54 BATT.2
N$24
  Top 0.305: C42.2 7.07,36.7 IC8.5
N$25
  Bottom 0.406: R51.2 38.21,67.53 T7.B
N$26
  Bottom 0.406: T8.3 36.26,72.83 36.58,72.52 37.05,72.52 R54.1 39.59,71.5 R55.2
N$27
  Top 0.406: RF.A 72.1,5.47 R28.2
N$28
  Top 0.2: R28.1 70.99,8.6 70.99,24.51 79.63,33.15 79.63,44.96 75.06,49.53 75.06,57.28 70.99,61.34 57.15,61.34 54.36,58.55 54.36,53.98 46.99,46.61 42.16,46.61 41.69,46.13 IC1.1
N$29
  Bottom 0.406: T7.C 39.71,69.55 R55.1
N$30
  Bottom 0.813: T8.4 34.01,74.89 D5.4 34.12,71.5 R54.2
N$31  (via drill 0.4)
  Top 0.2: v25.91,15.24 32.19,21.52 IC1.56
  Bottom 0.2: R38.2 24.6,6.57 25.78,7.75 25.78,15.11 v25.91,15.24
N$33
  Bottom 0.305: SYNC2.A 21.24,1.4 R38.1
N$34
  Top 0.2: LOW_BATT.A 52.74,75.94 R40.2
N$35
  Bottom 0.2: SYNC1.A 16.8,77.6 R32.1
N$37
  Bottom 0.406: R6.2 84.99,12 T1.B
N$38
  Top 0.305: IC5.9 80.38,71.49 81.41,72.52 81.41,74.95 L3.1
  Top 0.61: D7.C 84.55,68.99 81.3,72.25 L3.1
  Top 0.813: C36.2 81.08,74.89 L3.1
N$39
  Top 0.279: R64.2 77,69 77.27,69.27 77.27,70.79 77.47,70.99 IC5.8
  Top 0.305: IC5.8 79.25,70.99 80.01,70.23 80.01,69.37 D7.A
N$40  (via drill 0.4)
  Top 0.2: IC5.2 72.64,71.51 v72.42,71.73
  Bottom 0.2: v72.42,71.73 72.42,71.4 73.36,70.46 74.11,70.46 R63.1
N$41
  Top 0.61: R22.1 7.41,64.94 IR_SENS0.4
  Bottom 0.406: R23.2 8.89,59.18 8.13,59.94 8.13,60.78 IR_SENS0.4
N$42
  Bottom 0.406: T1.C 90.34,14.56 R10.1
N$43
  Top 0.2: IC5.4 73.03,70.49 72.77,70.23 72.77,68.49 C33.1
N$44  (via drill 0.4)
  Top 0.305: IC5.6 78.23,69.96 v78.23,69.6
  Bottom 0.305: v78.23,69.6 78.61,69.6 80.3,67.91 R71.2 R72.1
N$45
  Top 0.2: Q1.1 50.84,34.29 C1.1 46.42,38.71 IC1.91
N$46
  Top 0.2: IC1.92 45.18,39.21 47.59,41.62 C2.1 50.71,43.94 Q1.2
N$47
  Bottom 0.2: R70.1 13.97,26.29 19.32,20.94 IC4.10
N$48
  Top 0.305: IC5.10 78.2,72.78 C36.1
N$49
  Bottom 0.2: R44.2 20.15,50 21.34,51.18 22.35,51.18 22.79,51.62 IC2.19
N$50
  Bottom 0.2: IC2.17 24.09,50.04 R45.2
N$51
  Bottom 0.2: IC2.18 23.44,51.34 R49.2
N$52
  Bottom 0.2: IC2.16 24.74,51.42 R50.2
N$53
  Bottom 0.2: IC4.9 19.96,20.8 15.62,25.15 15.62,29.46 16,29.84 R68.1
N$54
  Bottom 0.2: IC4.7 21.27,20.52 16.38,25.4 16.38,27.56 17.27,28.45 18.63,28.45 R73.1
N$55
  Bottom 0.2: IC4.8 20.61,20.66 16,25.27 16,27.85 R69.1
N$56
  Top 0.406: R20.2 86.7,2.16 89.66,2.16 91.06,3.55 IR_SENSOR1.3
  Bottom 0.406: T2.5 T2.6 89.06,9.6 R18.2 | T2.5 T2.2 T2.1 | IR_SENSOR1.3 92.46,5.23 92.46,7.75 91.95,8.26 T2.5
N$57
  Bottom 0.406: R17.1 3.39,21.77 IDX1.LED_A
N$58  (via drill 0.6)
  Top 0.61: R22.2 9.11,67.13 v9.47,67.5 10.82,67.5 R26.2
  Bottom 0.61: IR_SENS0.3 2.69,64.36 2.29,64.77 2.29,66.55 2.92,67.18 9.16,67.18 T5.6 | T5.2 T5.1 T5.6 | T5.6 v9.47,67.5 9.47,66.55 T5.5
N$59
  Top 0.61: IC3.1 75.83,16.05 L2.2 80.77,17.45 80.77,18.29 81.83,19.34 D6.A
N$60  (via drill 0.4)
  Top 0.305: v72.39,15.49 73.15,15.49 73.22,15.05 IC3.3
  Bottom 0.305: R66.2 72.3,15.53 v72.39,15.49
  Bottom 0.61: R66.2 R65.2 C40.2
N$63
  Top 0.305: IC3.4 73.22,10.89
  Top 0.406: 73.22,10.89 R62.1
N$64  (via drill 0.4)
  other vias: 71.88,26.8
N$91  (via drill 0.4)
  Top 0.305: LK4.A v98.68,44.83
  Bottom 0.305: v98.68,44.83 R48.2
N$92  (via drill 0.4)
  Top 0.305: LK5.A v98.68,49.15
  Bottom 0.305: v98.68,49.15 R53.2
N$94
  Top 0.2: LIDX1.A 3.36,16.8 R59.2
N$128
  Bottom 0.406: R9.1 94.78,13.21 94.11,13.21 93.4,12.5 T2.3 92.9,13.87 R10.2
N$129
  Bottom 0.406: R19.2 87.2,9.61 R18.1 88.56,8.26 89.03,8.26 89.41,7.87 89.41,5.33 88.06,3.98 IR_SENSOR1.4
NRF_CSN_3V3
  Top 0.2: IC7.4 85.85,49.15 84.58,50.42 84.58,51.56 82.3,53.98 82.3,56.52 74.8,64.01 56.64,64.01 52.07,59.44 52.07,54.74 47.75,50.42 45.34,50.42 41.19,46.27 IC1.2
  Bottom 0.406: R67.1 85.85,46.77 IC7.4
NRF_MOSI_3V3  (via drill 0.4)
  Top 0.2: IC7.6 83.31,49.02 82.04,50.29 82.04,51.44 81.28,52.2 81.28,56.52 74.55,63.25 56.9,63.25 52.83,59.18 52.83,54.48 47.5,49.15 v46.99,49.15 | v34.8,49.53 33.4,48.13 33.02,48.13 32.19,47.3 IC1.20
  Bottom 0.2: v46.99,49.15 45.59,49.15 45.47,49.28 36.2,49.28 35.94,49.53 v34.8,49.53
ON/OFF_SENSOR_0_3V3  (via drill 0.4)
  Top 0.2: v15.37,46.1 17.27,46.1 21.21,42.16 22.86,42.16 24.81,40.21 IC1.32
  Bottom 0.2: R8.1 15.37,53.89 v15.37,46.1
  Bottom 0.406: R7.2 R8.1
ON/OFF_SENSOR_1_3V1
  Bottom 0.406: SW_BATT.3 39.37,59.82 39.37,63.94 R46.2 38.33,65.83 R51.1
ON/OFF_SENSOR_1_3V3  (via drill 0.4)
  Top 0.2: v63.88,65.41 63.75,65.28 56.39,65.28 50.93,59.82 50.93,55.12 47.62,51.82 v47.12,51.82 | v37.47,50.29 37.08,50.29 35.43,48.64 34.42,48.64 33.69,47.91 IC1.17
  Bottom 0.2: R5.2 82.17,14.9 82.17,18.29 75.69,24.77 75.69,57.91 68.83,64.77 64.52,64.77 v63.88,65.41 | v47.12,51.82 45.59,50.29 v37.47,50.29
  Bottom 0.406: R6.1 R5.2
PDI_DATA_3V3  (via drill 0.4)
  Top 0.2: v46.1,37.08 45.47,37.72 IC1.89
  Bottom 0.2: PDI_ATMEL.1 50.29,32.89 v46.1,37.08
RX_0_3V3  (via drill 0.4)
  Top 0.2: IC1.47 24.44,32.71 20.32,36.83 v17.78,36.83
  Top 0.305: v17.78,36.83 16.03,36.83 IC8.12
  Bottom 0.305: v17.78,36.83 16.85,37.76 15.24,37.76 R30.2
RX_0_RS232  (via drill 0.4)
  Top 0.2: v18.03,40.13 18.41,39.75 18.41,38.35 18.03,37.97 IC8.13
  Bottom 0.2: BAL1.8 25.78,68.38 25.78,70.61 24.26,72.14 14.73,72.14 14.22,71.63 14.22,66.55 16.51,64.26 16.51,55.63 16.13,55.24 16.13,42.67 18.03,40.77 v18.03,40.13
RX_1_3V3  (via drill 0.4)
  Top 0.2: IC1.51 25.91,29.21 20.45,34.67 18.41,34.67 16.64,32.89 IC8.9
  Top 0.305: v12.83,33.78 13.72,32.89 IC8.9
  Bottom 0.305: R37.1 9.02,37.59 v12.83,33.78
RX_1_RS232  (via drill 0.4)
  Top 0.2: IC8.8 9.88,32.77 11.68,32.77 12.7,31.75 v12.7,24.77
  Bottom 0.2: v12.7,24.77 15.5,21.96 BAL2.8
SYNC1_LED_3V3  (via drill 0.4)
  Top 0.2: IC1.35 25.17,38.71 24,39.88 v23.11,39.88 | v26.67,46.74 29.72,49.78 v29.72,50.29
  Bottom 0.2: R32.2 23.5,77.6 26.67,74.42 26.67,62.23 29.72,59.18 v29.72,50.29 | v23.11,39.88 22.86,40.26 22.86,43.31 v26.67,46.74
SYNC_IN_0_3V3  (via drill 0.4)
  Top 0.2: v24.26,37.72 24.52,37.71 IC1.37
  Bottom 0.2: IC2.15 25.4,52.07 25.78,51.69 26.92,51.69 27.3,51.31 27.3,46.1 27.05,45.85 27.05,44.83 24.77,42.55 24.26,42.55 23.75,42.04 23.75,41.15 24.51,40.39 24.51,37.97 v24.26,37.72
SYNC_IN_0_5V
  Bottom 0.2: IC2.9 24.74,63.86 BAL1.7
SYNC_IN_1_3V3  (via drill 0.4)
  Top 0.2: v24.38,41.66 25.33,40.71 IC1.31
  Bottom 0.2: IC2.14 26.04,52.2 26.16,52.07 27.05,52.07 27.69,51.44 27.69,45.97 27.43,45.72 27.43,44.7 v24.38,41.66
SYNC_IN_1_5V  (via drill 0.4)
  Top 0.2: v18.03,17.02 18.03,19.43 18.8,20.19 v18.8,27.81
  Bottom 0.2: IC2.10 25.4,57.78 22.35,54.74 19.3,54.74 18.8,54.23 18.8,43.56 20.95,41.4 20.95,29.34 19.43,27.81 v18.8,27.81 | v18.03,17.02 18.5,16.55 BAL2.7
SYNC_OUT_0_3V3  (via drill 0.4)
  Top 0.2: IC1.50 26.64,31.21 v26.04,30.61
  Bottom 0.2: IC4.21 23.21,29.84 23.98,30.61 v26.04,30.61
SYNC_OUT_0_5V  (via drill 0.4)
  Top 0.2: v24.13,29.46 19.68,33.91 v18.8,33.91
  Bottom 0.2: BAL1.3 20.23,71.37 17.53,71.37 17.27,71.12 17.27,55.24 16.89,54.86 16.89,42.93 19.05,40.77 19.05,34.16 v18.8,33.91 | IC4.3 23.86,21.32 25.91,23.37 25.91,27.69 v24.13,29.46
SYNC_OUT_1_3V3  (via drill 0.4)
  Top 0.2: IC1.49 25.87,31.71 v25.4,31.24
  Bottom 0.2: IC4.20 22.57,28.28 22.86,28.57 22.86,30.23 23.88,31.24 v25.4,31.24
SYNC_OUT_1_5V
  Bottom 0.2: BAL2.3 19.77,7.62 22.23,7.62 23.21,8.61 IC4.4
TX_0_3V3  (via drill 0.4)
  Top 0.2: IC8.11 21.08,35.43 24.3,32.21 IC1.48
  Top 0.305: v13.46,36.45 14.48,35.43 IC8.11
  Bottom 0.305: R33.2 13.46,37.25 v13.46,36.45
TX_0_RS232  (via drill 0.4)
  Top 0.2: v17.65,39.24 IC8.14
  Bottom 0.2: BAL1.4 22.85,71.75 17.4,71.75 16.89,71.25 16.89,55.37 16.51,54.99 16.51,42.8 18.67,40.64 18.67,39.62 18.29,39.24 v17.65,39.24
TX_1_3V3  (via drill 0.4)
  Top 0.2: IC1.52 30.19,30.27 29.84,30.61 29.21,30.61 28.19,29.59 26.16,29.59 21.97,33.78 21.59,34.16 20.7,35.05 17.91,35.05 17.02,34.16 IC8.10
  Top 0.305: v12.45,35.94 14.22,34.16 IC8.10
  Bottom 0.305: R39.1 11.05,36.45 11.56,35.94 v12.45,35.94
TX_1_RS232  (via drill 0.4)
  Top 0.2: IC8.7 11.43,34.16 13.46,32.13 v13.46,25.4
  Bottom 0.2: v13.46,25.4 13.46,24.51 15.88,22.1 15.88,17.65 16.89,16.64 16.89,10.54 15.5,9.15 BAL2.4
VBAT  (via drill 0.4, 0.6, 0.8)
  Top 0.305: v45.97,65.41 C24.+ | 74.17,72.14 R63.2 74.05,72.1 IC5.1 | 70.99,72.9 C26.1
  Top 0.406: 1.4,24.89 2.04,24.89 C32.1 | C26.1 70.61,72.9 70.36,73.15
  Top 0.61: 74.17,72.14 73.36,72.14 72.75,72.75 71.14,72.75 v70.87,73.03 | L2.1 79.05,9.85 76.05,12.85 IC3.5 75.12,11.18 | 75.12,11.18 75.12,10.89 R62.2 75.14,10.95 75.12,11.18 | v83.69,22.99 83.19,23.5 v74.8,23.5 | C32.1 v2.41,25.15
  Top 0.813: v41.53,74.17 41.53,67.69 42.61,66.61 C24.+ 46.1,66.73 46.1,67.69 46.35,67.94 50.04,67.94 55.24,73.15 70.36,73.15 71.12,73.15 C26.1 v70.87,73.03 | BAL1.5 17.45,65.15 25.91,65.15 26.42,65.66 45.85,65.66 v45.97,65.41 | v48.77,66.42 45.97,66.42 v45.97,65.41 | v1.4,23.62 1.4,24.89 | v12.32,52.83 12.32,56.39 19.68,63.75 26.29,63.75 27.18,64.64 45.21,64.64 v45.97,65.41 | v9.53,51.56 9.53,47.24 3.3,41.02 v3.3,40.26 | v12.57,12.83 13.72,13.97 23.5,13.97 24.5,12.96 BAL2.5
  Bottom 0.305: R60.2 45.97,64.07 v45.97,65.41
  Bottom 0.406: R63.2 73.27,72.1 72.59,72.77 71.4,72.77 71.37,72.75 71.02,72.75 C26.1 70.99,72.9 | T8.2 T8.1 | T8.5 T8.6 | v42.93,77.85 v41.53,77.85 v40.13,77.85 v38.73,77.85 v37.34,77.85 37.34,77.27 T8.5 | v42.93,75.69 v41.53,75.69 v40.13,75.69 v38.73,75.69 v37.47,75.69 37.47,76.89 T8.5
  Bottom 0.61: T8.6 T8.1 38.23,74.17 v38.73,74.17 | R62.2 74.89,10.66 C28.1 73.41,10.66 73.28,10.79 76.58,10.79 77.34,11.56 77.34,20.32 74.8,22.86 v74.8,23.5 | v2.41,25.15 2.31,25.25 | 2.31,26.39 2.03,26.67 IC6.1 | R76.1 83.95,22.73 v83.69,22.99
  Bottom 0.813: C26.1 v70.87,73.03 | v74.8,23.5 74.8,57.66 71.75,60.71 56.9,60.71 50.93,66.42 v48.77,66.42 | 2.31,25.25 2.31,26.39 | v9.53,51.56 11.18,51.56 v12.32,52.83 | 4.7,25.53 2.79,23.62 v1.4,23.62 | 4.7,25.53 5.59,24.64 11.43,24.64 14.61,21.46 14.61,18.8 12.57,16.76 v12.57,12.83 | 4.7,25.53 4.7,38.86 v3.3,40.26 R79.1
  Bottom 1.016: v38.73,74.17 v40.13,74.17 v41.53,74.17 v42.93,74.17
  other vias: 75.02,10.79
VCC_MOT0
  Bottom 0.61: MOT0.2 96.62,19.96 D2.C 93.66,20.15 C7.1 91.4,20.45 R77.2 88.2,20.57 R76.2
VCC_MOT1  (via drill 0.6)
  Top 0.813: R78.2 6.35,47.56 D1.C
  Bottom 0.813: R79.2 5.18,44.26 | 5.18,44.26 C6.1 | 5.18,44.26 5.18,45.17 D1.C 5.96,46.73 5.69,46.99 MOT1.2
  other vias: 6.35,46.33
XBEE_CTS_3V3/NRF_IRQ_3V3  (via drill 0.4, 0.8)
  Top 0.2: IC7.8 79.5,49.4 79.5,56.77 73.79,62.48 57.15,62.48 53.59,58.93 53.59,54.23 47.24,47.88 v46.48,47.88 | IC1.16 34.19,47.52 v34.54,47.88
  Top 0.305: XB1.12 76.57,45.23 v77.22,45.21
  Bottom 0.2: v34.54,47.88 35.18,48.51 43.81,48.51 45.09,47.24 45.85,47.24 v46.48,47.88
  Bottom 0.305: v77.22,45.21 77.85,45.21 IC7.8
XBEE_RTS_3V3/NRF_CE_3V3  (via drill 0.8)
  Top 0.2: IC7.3 85.85,51.69 82.8,54.74 82.8,56.52 74.93,64.39 56.52,64.39 51.69,59.56 51.69,54.86 47.62,50.8 45.21,50.8 42.16,47.75 40.01,47.75 39.69,47.43 IC1.5
  Top 0.305: XB1.16 77.71,37.23 v77.72,37.21
  Bottom 0.305: v77.72,37.21 84.58,44.07 84.58,49.4 IC7.3
XBEE_RX_3V3/NRF_MISO_3V3  (via drill 0.4)
  Top 0.2: XB1.2 92.94,31.23 92.06,32.11 92.06,37.1 82.04,47.12 82.04,49.4 IC7.7 80.77,56.13 74.04,62.87 57.02,62.87 53.21,59.05 53.21,54.36 47.37,48.51 46.23,48.51 v45.59,47.88 | v33.27,48.9 31.69,47.31 IC1.21
  Bottom 0.2: v45.59,47.88 44.58,48.9 v33.27,48.9
  Bottom 0.305: R43.2 92.94,31.23 XB1.2
XBEE_TX_3V3/NRF_SCK_3V3  (via drill 0.4)
  Top 0.2: XB1.3 93.1,33.23 92.56,33.76 92.56,38.63 84.58,46.61 84.58,49.4 IC7.5 83.31,51.94 81.79,53.47 81.79,56.52 74.68,63.63 56.77,63.63 52.45,59.31 52.45,54.61 47.62,49.78 v45.97,49.78 | v33.91,49.91 33.27,49.91 31.19,47.7 IC1.22
  Bottom 0.2: v45.97,49.78 45.59,49.66 36.7,49.66 36.2,50.16 34.16,50.16 v33.91,49.91
  Bottom 0.305: R42.2 93.1,33.23 XB1.3
(copper drawn outside any net)
  shapes: Bottom area x3, Top area x1

## Text on the board
tPlace: on<>off | - | + | - | prism_V2 / Ro'otter 2014 | + | beacon_id2 -> R4 / beacon_id1 -> R2 / beacon_id0 -> R1 | + | -